# Altium project Jetson AGX Xavier Carrier Board.PrjPcb (part 6 of 8)

## Sheet RGMII ETHERNET.SchDoc: RGMII Ethernet
size 431 x 279 mm; CheckedBy: Lance Bantoto; Engineer: Chealsie Bains; DocumentNumber: 17; Revision: 1; SheetNumber: 17; SheetTotal: 23
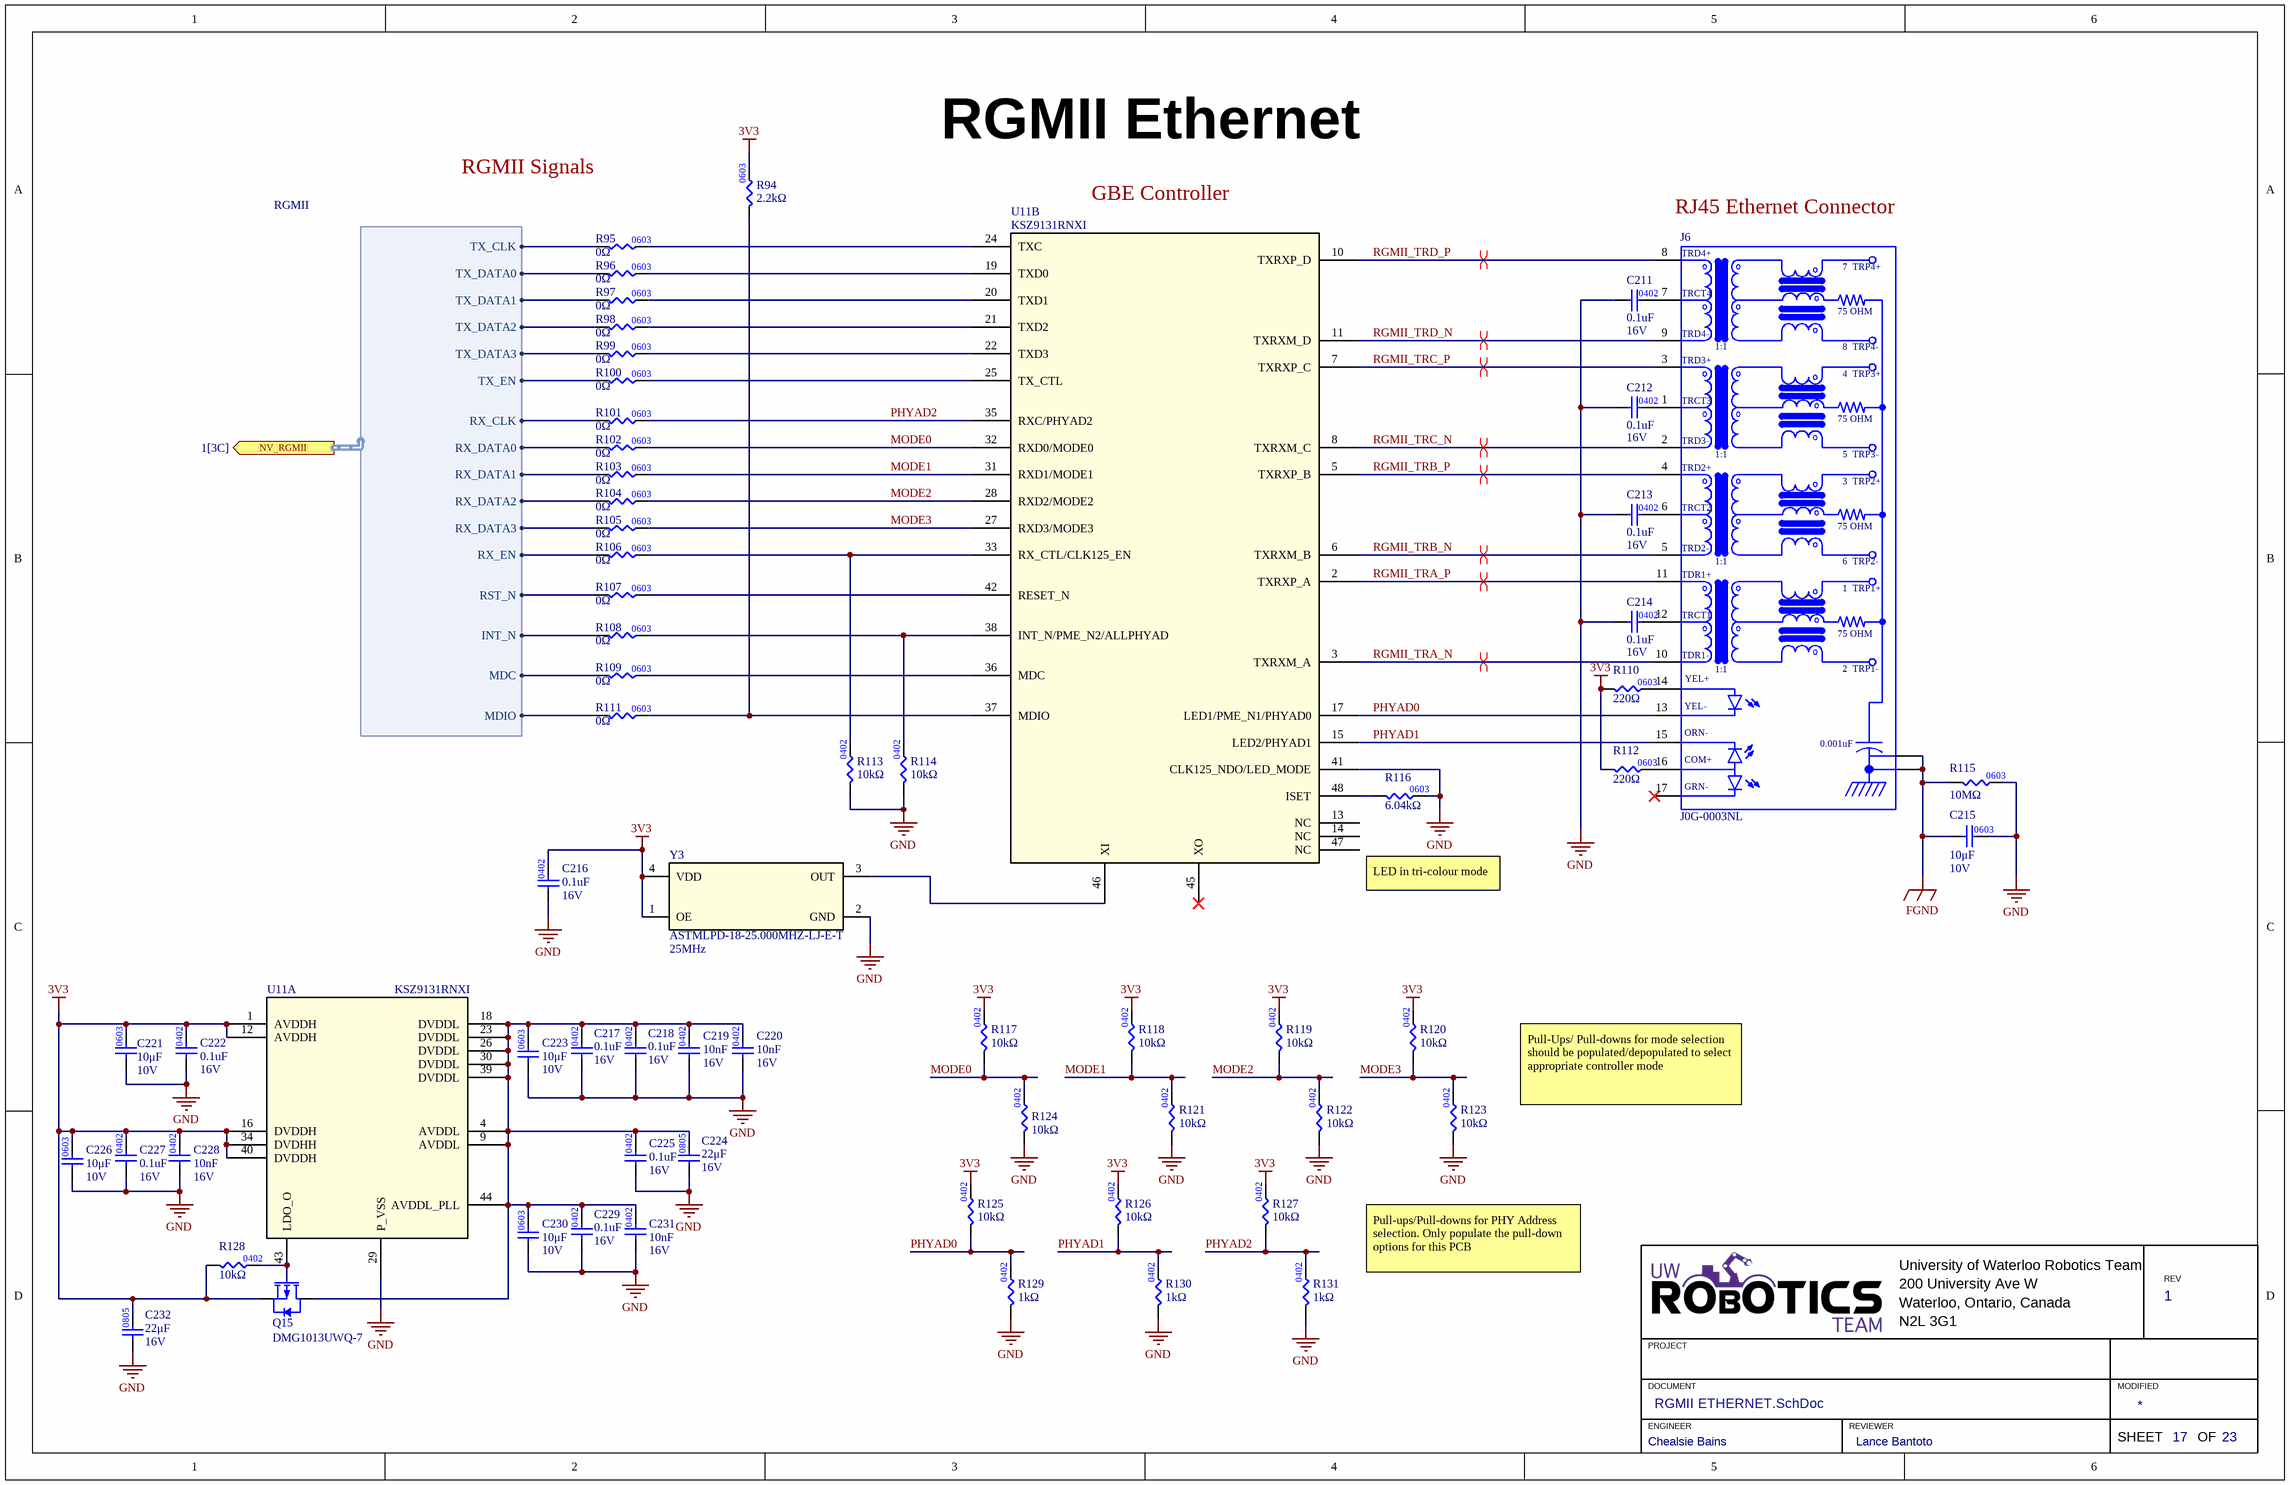
[diagram p19: RGMII ETHERNET.SchDoc]

### Parts
C211  Capacitance: 0.1uF  Rated DC Voltage (URdc): 16V  [CAP0402]  (hidden comment: CAP_0.1uF_16V_X7R_0402)
C212  Capacitance: 0.1uF  Rated DC Voltage (URdc): 16V  [CAP0402]  (hidden comment: CAP_0.1uF_16V_X7R_0402)
C213  Capacitance: 0.1uF  Rated DC Voltage (URdc): 16V  [CAP0402]  (hidden comment: CAP_0.1uF_16V_X7R_0402)
C214  Capacitance: 0.1uF  Rated DC Voltage (URdc): 16V  [CAP0402]  (hidden comment: CAP_0.1uF_16V_X7R_0402)
C215  value 10μF  Voltage Rating: 10V  [CAP0603]  (hidden comment: CAP_10uF_10V_0603)
C216  Capacitance: 0.1uF  Rated DC Voltage (URdc): 16V  [CAP0402]  (hidden comment: CAP_0.1uF_16V_X7R_0402)
C217  Capacitance: 0.1uF  Rated DC Voltage (URdc): 16V  [CAP0402]  (hidden comment: CAP_0.1uF_16V_X7R_0402)
C218  Capacitance: 0.1uF  Rated DC Voltage (URdc): 16V  [CAP0402]  (hidden comment: CAP_0.1uF_16V_X7R_0402)
C219  Capacitance: 10nF  Rated DC Voltage (URdc): 16V  [CAP0402]  (hidden comment: CAP_0.01uF_16V_X7R_0402)
C220  Capacitance: 10nF  Rated DC Voltage (URdc): 16V  [CAP0402]  (hidden comment: CAP_0.01uF_16V_X7R_0402)
C221  value 10μF  Voltage Rating: 10V  [CAP0603]  (hidden comment: CAP_10uF_10V_0603)
C222  Rated DC Voltage (URdc): 16V  Capacitance: 0.1uF  [CAP0402]  (hidden comment: CAP_0.1uF_16V_X7R_0402)
C223  value 10μF  Voltage Rating: 10V  [CAP0603]  (hidden comment: CAP_10uF_10V_0603)
C224  value 22μF  Voltage Rating: 16V  [CAP2012]  (hidden comment: CAP_22uF_16V_0805)
C225  Rated DC Voltage (URdc): 16V  Capacitance: 0.1uF  [CAP0402]  (hidden comment: CAP_0.1uF_16V_X7R_0402)
C226  value 10μF  Voltage Rating: 10V  [CAP0603]  (hidden comment: CAP_10uF_10V_0603)
C227  Rated DC Voltage (URdc): 16V  Capacitance: 0.1uF  [CAP0402]  (hidden comment: CAP_0.1uF_16V_X7R_0402)
C228  Capacitance: 10nF  Rated DC Voltage (URdc): 16V  [CAP0402]  (hidden comment: CAP_0.01uF_16V_X7R_0402)
C229  Capacitance: 0.1uF  Rated DC Voltage (URdc): 16V  [CAP0402]  (hidden comment: CAP_0.1uF_16V_X7R_0402)
C230  value 10μF  Voltage Rating: 10V  [CAP0603]  (hidden comment: CAP_10uF_10V_0603)
C231  Capacitance: 10nF  Rated DC Voltage (URdc): 16V  [CAP0402]  (hidden comment: CAP_0.01uF_16V_X7R_0402)
C232  value 22μF  Voltage Rating: 16V  [CAP2012]  (hidden comment: CAP_22uF_16V_0805)
J6  J0G-0003NL  [PULSE_J0G-0003NL]
Q15  Manufacturer Part Number: DMG1013UWQ-7  (hidden comment: PMOS_20V_820MA SOT323)
R94  value 2.2kΩ  [RES0603]  (hidden comment: RES_2.2kΩ_0603_1%)
R95  value 0Ω  [RES0603]  (hidden comment: RES_0Ω_0603)
R96  value 0Ω  [RES0603]  (hidden comment: RES_0Ω_0603)
R97  value 0Ω  [RES0603]  (hidden comment: RES_0Ω_0603)
R98  value 0Ω  [RES0603]  (hidden comment: RES_0Ω_0603)
R99  value 0Ω  [RES0603]  (hidden comment: RES_0Ω_0603)
R100  value 0Ω  [RES0603]  (hidden comment: RES_0Ω_0603)
R101  value 0Ω  [RES0603]  (hidden comment: RES_0Ω_0603)
R102  value 0Ω  [RES0603]  (hidden comment: RES_0Ω_0603)
R103  value 0Ω  [RES0603]  (hidden comment: RES_0Ω_0603)
R104  value 0Ω  [RES0603]  (hidden comment: RES_0Ω_0603)
R105  value 0Ω  [RES0603]  (hidden comment: RES_0Ω_0603)
R106  value 0Ω  [RES0603]  (hidden comment: RES_0Ω_0603)
R107  value 0Ω  [RES0603]  (hidden comment: RES_0Ω_0603)
R108  value 0Ω  [RES0603]  (hidden comment: RES_0Ω_0603)
R109  value 0Ω  [RES0603]  (hidden comment: RES_0Ω_0603)
R110  value 220Ω  [RES0603]  (hidden comment: RES_220Ω_0603)
R111  value 0Ω  [RES0603]  (hidden comment: RES_0Ω_0603)
R112  value 220Ω  [RES0603]  (hidden comment: RES_220Ω_0603)
R113  Resistance: 10kΩ  [RES0402]  (hidden comment: RES_10kΩ_0402_1%)
R114  Resistance: 10kΩ  [RES0402]  (hidden comment: RES_10kΩ_0402_1%)
R115  value 10MΩ  [RES0603]  (hidden comment: RES_10MΩ_0603)
R116  value 6.04kΩ  [RES0603]  (hidden comment: RES_6.04kΩ_0603_1%)
R117  Resistance: 10kΩ  [RES0402]  (hidden comment: RES_10kΩ_0402_1%)
R118  Resistance: 10kΩ  [RES0402]  (hidden comment: RES_10kΩ_0402_1%)
R119  Resistance: 10kΩ  [RES0402]  (hidden comment: RES_10kΩ_0402_1%)
R120  Resistance: 10kΩ  [RES0402]  (hidden comment: RES_10kΩ_0402_1%)
R121  Resistance: 10kΩ  [RES0402]  (hidden comment: RES_10kΩ_0402_1%)
R122  Resistance: 10kΩ  [RES0402]  (hidden comment: RES_10kΩ_0402_1%)
R123  Resistance: 10kΩ  [RES0402]  (hidden comment: RES_10kΩ_0402_1%)
R124  Resistance: 10kΩ  [RES0402]  (hidden comment: RES_10kΩ_0402_1%)
R125  Resistance: 10kΩ  [RES0402]  (hidden comment: RES_10kΩ_0402_1%)
R126  Resistance: 10kΩ  [RES0402]  (hidden comment: RES_10kΩ_0402_1%)
R127  Resistance: 10kΩ  [RES0402]  (hidden comment: RES_10kΩ_0402_1%)
R128  Resistance: 10kΩ  [RES0805]  (hidden comment: RES_10kΩ_0402)
R129  value 1kΩ  [RES0402]  (hidden comment: RES_1kΩ_0402_1%)
R130  value 1kΩ  [RES0402]  (hidden comment: RES_1kΩ_0402_1%)
R131  value 1kΩ  [RES0402]  (hidden comment: RES_1kΩ_0402_1%)
U11  KSZ9131RNXI  [KSZ9131RNXI]  (parts A,B of 2)
Y3  ASTMLPD-18-25.000MHZ-LJ-E-T  value 25MHz  [ASTMLPE_ABR]

### Ports
NV_RGMII (out, harness RGMII, see 1[3C])

### Harnesses
RGMII: TX_CLK, TX_DATA0, TX_DATA1, TX_DATA3, TX_DATA2, TX_EN, RX_CLK, RX_DATA0, RX_DATA1, RX_DATA2, RX_DATA3, RX_EN, RST_N, INT_N, MDC, MDIO

### Nets
3V3: C216.2 C221.2 C222.2 C226.2 C227.2 C228.2 C232.2 Q15.3(Source) R94.2 R110.1 R112.1 R117.2 R118.2 R119.2 R120.2 R125.2 R126.2 R127.2 R128.1 U11.1(AVDDH) U11.12(AVDDH) U11.16(DVDDH) U11.34(DVDHH) U11.40(DVDDH) Y3.1(OE) Y3.4(VDD)
FGND: C215.1 J6.SH1(SHIELD) J6.SH2(SHIELD) R115.1
GND: C211.1 C212.1 C213.1 C214.1 C215.2 C216.1 C217.1 C218.1 C219.1 C220.1 C221.1 C222.1 C223.1 C224.1 C225.1 C226.1 C227.1 C228.1 C229.1 C230.1 C231.1 C232.1 R113.1 R114.1 R115.2 R116.2 R121.1 R122.1 R123.1 R124.1 R129.1 R130.1 R131.1 U11.29(P_VSS) U11.41(CLK125_NDO/LED_MODE) Y3.2(GND)
MODE0: R102.2 R117.1 R124.2 U11.32(RXD0/MODE0)
MODE1: R103.2 R118.1 R121.2 U11.31(RXD1/MODE1)
MODE2: R104.2 R119.1 R122.2 U11.28(RXD2/MODE2)
MODE3: R105.2 R120.1 R123.2 U11.27(RXD3/MODE3)
NV_RGMII.INT_N: R108.1 ; port NV_RGMII.INT_N
NV_RGMII.MDC: R109.1 ; port NV_RGMII.MDC
NV_RGMII.MDIO: R111.1 ; port NV_RGMII.MDIO
NV_RGMII.RST_N: R107.1 ; port NV_RGMII.RST_N
NV_RGMII.RX_CLK: R101.1 ; port NV_RGMII.RX_CLK
NV_RGMII.RX_DATA0: R102.1 ; port NV_RGMII.RX_DATA0
NV_RGMII.RX_DATA1: R103.1 ; port NV_RGMII.RX_DATA1
NV_RGMII.RX_DATA2: R104.1 ; port NV_RGMII.RX_DATA2
NV_RGMII.RX_DATA3: R105.1 ; port NV_RGMII.RX_DATA3
NV_RGMII.RX_EN: R106.1 ; port NV_RGMII.RX_EN
NV_RGMII.TX_CLK: R95.1 ; port NV_RGMII.TX_CLK
NV_RGMII.TX_DATA0: R96.1 ; port NV_RGMII.TX_DATA0
NV_RGMII.TX_DATA1: R97.1 ; port NV_RGMII.TX_DATA1
NV_RGMII.TX_DATA2: R98.1 ; port NV_RGMII.TX_DATA2
NV_RGMII.TX_DATA3: R99.1 ; port NV_RGMII.TX_DATA3
NV_RGMII.TX_EN: R100.1 ; port NV_RGMII.TX_EN
PHYAD0: J6.13(YEL-) R125.1 R129.2 U11.17(LED1/PME_N1/PHYAD0)
PHYAD1: J6.15(ORN-) R126.1 R130.2 U11.15(LED2/PHYAD1)
PHYAD2: R101.2 R127.1 R131.2 U11.35(RXC/PHYAD2)
RGMII_TRA_N: J6.10(TDR1-) U11.3(TXRXM_A)
RGMII_TRA_P: J6.11(TDR1+) U11.2(TXRXP_A)
RGMII_TRB_N: J6.5(TRD2-) U11.6(TXRXM_B)
RGMII_TRB_P: J6.4(TRD2+) U11.5(TXRXP_B)
RGMII_TRC_N: J6.2(TRD3-) U11.8(TXRXM_C)
RGMII_TRC_P: J6.3(TRD3+) U11.7(TXRXP_C)
RGMII_TRD_N: J6.9(TRD4-) U11.11(TXRXM_D)
RGMII_TRD_P: J6.8(TRD4+) U11.10(TXRXP_D)
NetC211_2: C211.2 J6.7(TRCT4)
NetC212_2: C212.2 J6.1(TRCT3)
NetC213_2: C213.2 J6.6(TRCT2)
NetC214_2: C214.2 J6.12(TRCT1)
NetC217_2: C217.2 C218.2 C219.2 C220.2 C223.2 C224.2 C225.2 C229.2 C230.2 C231.2 Q15.1(Drain) U11.4(AVDDL) U11.9(AVDDL) U11.18(DVDDL) U11.23(DVDDL) U11.26(DVDDL) U11.30(DVDDL) U11.39(DVDDL) U11.44(AVDDL_PLL)
NetJ6_14: J6.14(YEL+) R110.2
NetJ6_16: J6.16(COM+) R112.2
NetQ15_2: Q15.2(Gate) R128.2 U11.43(LDO_O)
NetR94_1: R94.1 R111.2 U11.37(MDIO)
NetR95_2: R95.2 U11.24(TXC)
NetR96_2: R96.2 U11.19(TXD0)
NetR97_2: R97.2 U11.20(TXD1)
NetR98_2: R98.2 U11.21(TXD2)
NetR99_2: R99.2 U11.22(TXD3)
NetR100_2: R100.2 U11.25(TX_CTL)
NetR106_2: R106.2 R113.2 U11.33(RX_CTL/CLK125_EN)
NetR107_2: R107.2 U11.42(RESET_N)
NetR108_2: R108.2 R114.2 U11.38(INT_N/PME_N2/ALLPHYAD)
NetR109_2: R109.2 U11.36(MDC)
NetR116_1: R116.1 U11.48(ISET)
NetU11_46: U11.46(XI) Y3.3(OUT)

Not connected (* = marked no-connect by the designer): J6 17(GRN-)*; U11 13(NC) 14(NC) 45(XO)* 47(NC)

### Layout directives
differential pair: RGMII_TRA_N, RGMII_TRA_P, RGMII_TRB_N, RGMII_TRB_P, RGMII_TRC_N, RGMII_TRC_P, RGMII_TRD_N, RGMII_TRD_P

### Notes on the sheet
- RGMII Signals
- (near U11) GBE Controller
- (near J6) RJ45 Ethernet Connector
- LED in tri-colour mode
- Pull-Ups/ Pull-downs for mode selection should be populated/depopulated to select appropriate controller mode
- Pull-ups/Pull-downs for PHY Address selection. Only populate the pull-down options for this PCB
- University of Waterloo Robotics Team
- 200 University Ave W
- REV
- PROJECT
- Waterloo, Ontario, Canada
- N2L 3G1
- DOCUMENT
- ENGINEER
- REVIEWER
- MODIFIED
- SHEET
- OF
- (in symbol CAP_10uF_10V_0603) 0603
- (in symbol J0G-0003NL) 7  TRP4+; 75 OHM; 1:1; 8  TRP4-; 4  TRP3+; 5  TRP3-; 3  TRP2+; 6  TRP2-; 1  TRP1+; 2  TRP1-; 0.001uF
- (in symbol RES_10MΩ_0603_5%) 0603

### Library data of the parts
C211-C214 C216-C218 C222 C225 C227 C229 = CAP_0.1uF_16V_X7R_0402: Ceramic Capacitor, Ceramic; Manufacturer: Taiyo Yuden; Manufacturer Part Number: LMK212AC6106MD-T; Multilayer: Yes; Negative Tolerance: 10%; Temperature Characteristics Code: X7R; Supplier 1: Digi-Key; Supplier Part Number 1: 587-6337-1-ND; RoHS: Yes; Stock 1: 703; Pricing 1: 1=0.29000, 10=0.20100, 50=0.12060, 100=0.10180, 500=0.06966, 1000=0.06163 (USD); ComponentLink1URL: https://datasheet.ciiva.com:443/pdfs/VipMasterIC/IC/TAIY/TAIY-S-A0009099504/TAIY-S-A0009099407-1.pdf?src-supplier=IHS+Markit; ComponentLink1Description: https://datasheet.ciiva.com:443/pdfs/VipMasterIC/IC/TAIY/TAIY-S-A0009099504/TAIY-S-A0009099407-1.pdf?src-supplier=IHS+Markit; ComponentLink2URL: https://ds.yuden.co.jp/TYCOMPAS/ut/detail?pn=LMK212AC6106MD-T &amp;u=M&src-supplier=Digi-Key; ComponentLink2Description: https://ds.yuden.co.jp/TYCOMPAS/ut/detail?pn=LMK212AC6106MD-T &amp;u=M&src-supplier=Digi-Key; Supplier 2: Digi-Key; Supplier Part Number 2: 1292-1630-1-ND; Category: Ceramic Capacitors; Stock 2: 20327886; Pricing 2: 1=0.10000, 10=0.02800, 50=0.01500, 100=0.01220, 500=0.00876, 1000=0.00688, 2500=0.00625, 5000=0.00575 (USD); Mount: Surface Mount; Number of Pins: 2; Dielectric Material: Ceramic; Package Shape: Rectangular; Terminal Finish: Nickel; Min Operating Temperature: -55°C; Max Operating Temperature: 125°C; JESD-609 Code: e3; Capacitor Type: Ceramic; Package Style: SMTMeter; Packaging: Tape and Reel; Positive Tolerance: 10%; Termination: Wraparound; Length: 1mm; Width: 0.5mm; Height: 0.5mm; REACH SVHC: Yes; RoHS Compliant: Yes; ComponentLink3URL: https://datasheet.ciiva.com:443/pdfs/VipMasterIC/IC/WATC/WATC-S-A0009550342/WATC-S-A0009550342-1.pdf?src-supplier=IHS+Markit; ComponentLink3Description: https://datasheet.ciiva.com:443/pdfs/VipMasterIC/IC/WATC/WATC-S-A0009550342/WATC-S-A0009550342-1.pdf?src-supplier=IHS+Markit; ComponentLink4URL: http://www.farnell.com/datasheets/2340522.pdf?src-supplier=Farnell; ComponentLink4Description: http://www.farnell.com/datasheets/2340522.pdf?src-supplier=Farnell; ComponentLink5URL: http://components.arrow.com/part/dataview/0323_00654690?src-supplier=Arrow+Europe; ComponentLink5Description: http://components.arrow.com/part/dataview/0323_00654690?src-supplier=Arrow+Europe; ComponentLink6URL: https://www.verical.com/server-webapp/html/getDatasheet?partID=415228&src-supplier=Verical; ComponentLink6Description: https://www.verical.com/server-webapp/html/getDatasheet?partID=415228&src-supplier=Verical; ComponentLink7URL: http://www.passivecomponent.com/indexsea/0402B104K160CT-IN.pdf?src-supplier=Digi-Key; ComponentLink7Description: http://www.passivecomponent.com/indexsea/0402B104K160CT-IN.pdf?src-supplier=Digi-Key; ComponentLink8URL: http://www.passivecomponent.com/wp-content/uploads/2018/10/MLCC.pdf?src-supplier=Digi-Key; ComponentLink8Description: http://www.passivecomponent.com/wp-content/uploads/2018/10/MLCC.pdf?src-supplier=Digi-Key; ComponentLink9URL: http://www.farnell.com/datasheets/2340522.pdf?src-supplier=Element14; ComponentLink9Description: http://www.farnell.com/datasheets/2340522.pdf?src-supplier=Element14; ComponentLink10URL: http://www.farnell.com/datasheets/2340522.pdf?src-supplier=Newark; ComponentLink10Description: http://www.farnell.com/datasheets/2340522.pdf?src-supplier=Newark; Size Code: 0402; Supplier 3: Digi-Key; Supplier Part Number 3: 445-173645-1-ND; Stock 3: 3627; Pricing 3: 1=0.20000, 10=0.14200, 50=0.08080, 100=0.06700, 500=0.04696, 1000=0.03888, 2500=0.03619, 5000=0.03311 (USD); ComponentLink11URL: https://datasheet.ciiva.com:443/pdfs/VipMasterIC/IC/TDKC/TDKC-S-A0007785269/TDKC-S-A0007785269-1.pdf?src-supplier=IHS+Markit; ComponentLink11Description: https://datasheet.ciiva.com:443/pdfs/VipMasterIC/IC/TDKC/TDKC-S-A0007785269/TDKC-S-A0007785269-1.pdf?src-supplier=IHS+Markit; ComponentLink12URL: https://product.tdk.com/info/en/catalog/spec/mlccspec_commercial_soft_en.pdf?src-supplier=Digi-Key; ComponentLink12Description: https://product.tdk.com/info/en/catalog/spec/mlccspec_commercial_soft_en.pdf?src-supplier=Digi-Key
C215 C221 C223 C226 C230 = CAP_10uF_10V_0603: CAP CER 10UF 10V X5R 0603; Manufacturer Part Number 1: CC0603MRX5R6BB106; Manufacturer 1: Yageo; Supplier Part Number 1: 311-1817-1-ND; Supplier 1: Digi-Key; Dielectric: X5R
C219 C220 C228 C231 = CAP_0.01uF_16V_X7R_0402: Ceramic Capacitor, Multilayer, Ceramic, 16V, 5% +Tol, 5% -Tol, X7R, 15% TC, 0.01uF, Surface Mount, 0402; Manufacturer: KEMET; Manufacturer Part Number: C0402C103J4RACTU; Multilayer: Yes; Supplier 1: Digi-Key; Supplier Part Number 1: 399-1039-1-ND; RoHS: Yes; Category: Ceramic Capacitors; Stock 1: 29300; Pricing 1: 1=0.10000, 10=0.04000, 50=0.02200, 100=0.01800, 500=0.01288, 1000=0.01012, 2500=0.00920, 5000=0.00846 (USD); Mount: Surface Mount; Number of Pins: 2; Dielectric Material: Ceramic; Package Shape: Rectangular; Terminal Finish: Nickel; Min Operating Temperature: -55°C; Max Operating Temperature: 125°C; JESD-609 Code: e3; Capacitor Type: Ceramic; Negative Tolerance: 5%; Package Style: SMTMeter; Packaging: Tape and Reel; Positive Tolerance: 5%; Temperature Characteristics Code: X7R; Termination: Wraparound; Length: 1mm; Width: 0.5mm; Height: 0.5mm; REACH SVHC: Yes; RoHS Compliant: Yes; ComponentLink1URL: https://datasheet.ciiva.com:443/pdfs/VipMasterIC/IC/KEME/KEME-S-A0008991654/KEME-S-A0008991654-1.pdf?src-supplier=IHS+Markit; ComponentLink1Description: https://datasheet.ciiva.com:443/pdfs/VipMasterIC/IC/KEME/KEME-S-A0008991654/KEME-S-A0008991654-1.pdf?src-supplier=IHS+Markit; ComponentLink2URL: https://datasheet.ciiva.com/14593/70095383-14593069.pdf?src-supplier=Allied+Electronics; ComponentLink2Description: https://datasheet.ciiva.com/14593/70095383-14593069.pdf?src-supplier=Allied+Electronics; ComponentLink3URL: https://datasheet.ciiva.com/14604/70095383-14604557.pdf?src-supplier=Allied+Electronics; ComponentLink3Description: https://datasheet.ciiva.com/14604/70095383-14604557.pdf?src-supplier=Allied+Electronics; ComponentLink4URL: https://datasheet.ciiva.com/7747/kem-c1002-x7r-smd-7747611.pdf?src-supplier=Element14; ComponentLink4Description: https://datasheet.ciiva.com/7747/kem-c1002-x7r-smd-7747611.pdf?src-supplier=Element14; ComponentLink5URL: https://datasheet.ciiva.com/46448/1851736-46448647.pdf?src-supplier=Element14; ComponentLink5Description: https://datasheet.ciiva.com/46448/1851736-46448647.pdf?src-supplier=Element14; ComponentLink6URL: https://datasheet.ciiva.com/28645/1851736-28645374.pdf?src-supplier=Element14; ComponentLink6Description: https://datasheet.ciiva.com/28645/1851736-28645374.pdf?src-supplier=Element14; Size Code: 0402
C224 C232 = CAP_22uF_16V_0805: CAP CER 22UF 16V X5R 0805; Manufacturer 1: Murata Electronics; Manufacturer Part Number 1: GRM219R61C226ME15L; Package/Footprint: 0805; Mounting Type: SMD; Supplier 1: Digi-Key; Supplier Part Number 1: 490-9952-1-ND; Dielectric: X5R
J6 = J0G-0003NL: 1 Port RJ45 Magjack Connector Through Hole 10/100/1000 Base-T, AutoMDIX; MF: Pulse Electronics; Digi-Key_Part_Number: 553-1852-ND; Package: Custom Package Pulse Electronics Network; MP: J0G-0003NL; SnapEDA_Link: https://www.snapeda.com/parts/J0G-0003NL/Pulse%20Electronics%20Network/view-part/368728/?ref=snap; Digi-Key_Purchase_URL: https://www.digikey.com/product-detail/en/pulse-electronics-network/J0G-0003NL/553-1852-ND/2264761?utm_source=snapeda&utm_medium=aggregator&utm_campaign=symbol; Value: *
Q15 = PMOS_20V_820MA SOT323: Small Signal Field-Effect Transistor, 0.82A I(D), 20V, 1-Element, P-Channel, Silicon, Metal-oxide Semiconductor FET; Manufacturer: Diodes; Supplier 1: Digi-Key; Supplier Part Number 1: DMG1013UWQ-7DICT-ND; RoHS: Yes; Category: MOSFETs; Stock 1: 30274; Pricing 1: 1=0.37000, 10=0.27300, 25=0.23880, 100=0.15450, 500=0.10230, 1000=0.07843 (USD); ComponentLink1URL: https://datasheet.ciiva.com:443/pdfs/VipMasterIC/IC/DIOD/DIOD-S-A0002497929/DIOD-S-A0002497929-1.pdf?src-supplier=IHS+Markit; ComponentLink1Description: https://datasheet.ciiva.com:443/pdfs/VipMasterIC/IC/DIOD/DIOD-S-A0002497929/DIOD-S-A0002497929-1.pdf?src-supplier=IHS+Markit; ComponentLink2URL: http://www.farnell.com/datasheets/2814383.pdf?src-supplier=Farnell; ComponentLink2Description: http://www.farnell.com/datasheets/2814383.pdf?src-supplier=Farnell; ComponentLink3URL: http://www.mouser.com/ds/2/115/DMG1013UWQ-892513.pdf?src-supplier=Mouser; ComponentLink3Description: http://www.mouser.com/ds/2/115/DMG1013UWQ-892513.pdf?src-supplier=Mouser; ComponentLink4URL: https://www.diodes.com/assets/Datasheets/DMG1013UWQ.pdf?src-supplier=Digi-Key; ComponentLink4Description: https://www.diodes.com/assets/Datasheets/DMG1013UWQ.pdf?src-supplier=Digi-Key; ComponentLink5URL: http://www.farnell.com/datasheets/2814383.pdf?src-supplier=Element14; ComponentLink5Description: http://www.farnell.com/datasheets/2814383.pdf?src-supplier=Element14; ComponentLink6URL: http://www.farnell.com/datasheets/2814383.pdf?src-supplier=Newark; ComponentLink6Description: http://www.farnell.com/datasheets/2814383.pdf?src-supplier=Newark
R94 = RES_2.2kΩ_0603_1%: RES 2.2K OHM 1% 1/10W 0603; Manufacturer 1: Yageo; Manufacturer Part Number 1: RC0603FR-072K2L; Supplier Part Number 1: 311-2.20KHRCT-ND; Supplier 1: Digi-Key; Mounting Type: SMD; Package: 0603
R95-R109 R111 = RES_0Ω_0603: RES 0 OHM JUMPER 1/10W 0603; Manufacturer 1: Yageo; Manufacturer Part Number 1: RC0603JR-070RL; Package/Footprint: 0603; Supplier Part Number 1: 311-0.0GRCT-ND; Supplier 1: Digi-Key; Mounting Type: SMD
R110 R112 = RES_220Ω_0603_5%: RES 220 OHM 5% 1/10W 0603; Manufacturer 1: Yageo; Manufacturer Part Number 1: AC0603JR-07220RL; Package/Footprint: 0603; Supplier Part Number 1: YAG3652CT-ND; Supplier 1: Digi-Key
R113 R114 R117-R127 = RES_10kΩ_0402_1%: RES 10K OHM 1% 1/16W 0402; Manufacturer 1: Samsung Electro-Mechanics; Manufacturer Part Number 1: RC1005F103CS; Supplier 1: Digi-Key; Supplier Part Number 1: 1276-3431-1-ND; Tolerance: 1%; Package: 0402
R115 = RES_10MΩ_0603_5%: RES 10M OHM 5% 1/10W 0603; Manufacturer 1: Vishay Dale; Manufacturer Part Number 1: CRCW060310M0JNEA; Supplier Part Number 1: 541-10MGCT-ND; Supplier 1: Digi-Key
R116 = RES_6.04kΩ_0603_1%: RES 6.04K OHM 1% 1/10W 0603; Manufacturer 1: Panasonic Electronic Components; Manufacturer Part Number 1: ERJ-PB3D6041V; Package/Footprint: 0603; Supplier 1: Digi-Key; Supplier Part Number 1: P20372CT-ND; Mounting Type: SMD
R128 = RES_10kΩ_0402: Fixed Resistor, Thin Film, 0.1W, 10000ohm, 50V, 0.1% +/-Tol, 25ppm/Cel, Surface Mount, 0402; Manufacturer 1: Panasonic; Manufacturer Part Number 1: ERJ-PB6B6043V; Manufacturer: Stackpole Electronics; Manufacturer Part Number: RNCF0402BTE10K0; Additional Feature: PRECISION; Rated Power Dissipation (P): 63mW; Rated Temperature: 70°C; Temperature Coefficient: 25ppm/°C; Working Voltage: 25V; Package Height: 0.3mm; Package Length: 1mm; Package Width: 0.5mm; Reference Standard: AEC-Q200; Supplier 1: Digi-Key; Supplier Part Number 1: P20911CT-ND; Supplier 2: Digi-Key; Supplier Part Number 2: RNCF0402BTE10K0CT-ND; RoHS: Yes; Category: Chip SMD Resistors; Stock 2: 76384; Pricing 2: 1=0.36000, 10=0.25900, 100=0.10350, 1000=0.05100, 2500=0.04725, 5000=0.04275 (USD); Mount: Surface Mount; Number of Pins: 2; Package Shape: Rectangular; Terminal Finish: Nickel; Min Operating Temperature: -55°C; Max Operating Temperature: 155°C; Tolerance: 0.1%; JESD-609 Code: e3; Resistor Type: FIXED RESISTOR; Construction: Rectangular; Package Style: SMTMeter; Packaging: Tape and Reel; Technology: THIN FILM; Termination: Wraparound; REACH SVHC: Yes; RoHS Compliant: Yes; ComponentLink1URL: https://datasheet.ciiva.com:443/pdfs/VipMasterIC/IC/SEIE/SEIE-S-A0009648208/SEIE-S-A0009648208-1.pdf?src-supplier=IHS+Markit; ComponentLink1Description: https://datasheet.ciiva.com:443/pdfs/VipMasterIC/IC/SEIE/SEIE-S-A0009648208/SEIE-S-A0009648208-1.pdf?src-supplier=IHS+Markit; ComponentLink2URL: https://www.seielect.com/catalog/SEI-Packaging.pdf?src-supplier=Digi-Key; ComponentLink2Description: https://www.seielect.com/catalog/SEI-Packaging.pdf?src-supplier=Digi-Key; ComponentLink3URL: https://www.seielect.com/Catalog/SEI-rncf.pdf?src-supplier=Avnet; ComponentLink3Description: https://www.seielect.com/Catalog/SEI-rncf.pdf?src-supplier=Avnet; Size Code: 0402
R129-R131 = RES_1kΩ_0402_1%: RES 1K OHM 1% 1/16W 0402; Manufacturer 1: Stackpole Electronics; Manufacturer Part Number 1: RMCF0402FT1K00; Supplier 1: Digi-Key; Supplier Part Number 1: RMCF0402FT1K00CT-ND; Tolerance: 1%; Package: 0402
U11 = KSZ9131RNXI: Ethernet Transceiver, PQCC48; Manufacturer: Microchip Technologies; Manufacturer Product Number: KSZ9131RNXI
Y3 = ASTMLPD-18-25.000MHZ-LJ-E-T: MEMS OSC XO 25.0000MHZ LVCMOS; Manufacturer 1: Abracon; Manufacturer Part Number 1: ASTMLPD-18-25.000MHZ-LJ-E-T; Supplier 1: Digi-Key; Supplier Part Number 1: 535-13096-1-ND

## Sheet System.SchDoc: System
size 431 x 279 mm; CheckedBy: Lance Bantoto; Engineer: Chealsie Bains; DocumentNumber: 12; Revision: 1; SheetNumber: 12; SheetTotal: 23
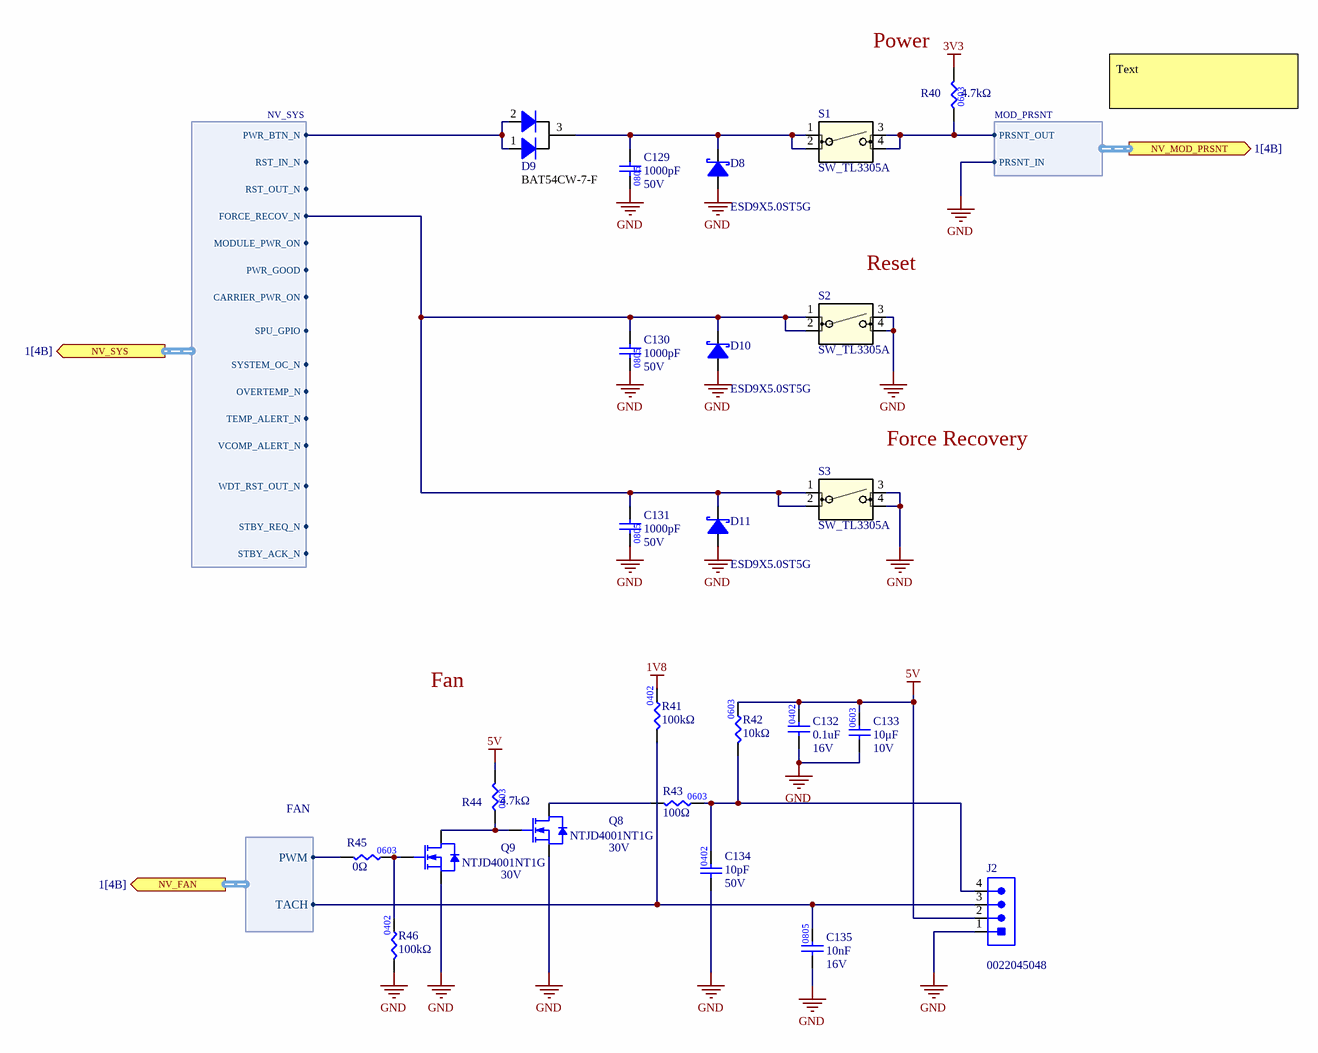
[diagram p20: System.SchDoc]

### Parts
C129  value 1000pF  Voltage Rating: 50V  [CAP2012]  (hidden comment: CAP_1000pF_50V_0805)
C130  value 1000pF  Voltage Rating: 50V  [CAP2012]  (hidden comment: CAP_1000pF_50V_0805)
C131  value 1000pF  Voltage Rating: 50V  [CAP2012]  (hidden comment: CAP_1000pF_50V_0805)
C132  Rated DC Voltage (URdc): 16V  Capacitance: 0.1uF  [CAP0402]  (hidden comment: CAP_0.1uF_16V_X7R_0402)
C133  value 10μF  Voltage Rating: 10V  [CAP0603]  (hidden comment: CAP_10uF_10V_0603)
C134  Capacitance: 10pF  Voltage: 50V  [CAP0402]  (hidden comment: CAP_10pF_50V_0402)
C135  value 10nF  Voltage Rating: 16V  [CAP2012]  (hidden comment: CAP_10nF_16V_0805)
D8  Manufacturer Part Number 1: ESD9X5.0ST5G  [SOD-923]  (hidden comment: TVS_DIODE_UNIDIR_5V)
D9  BAT54CW-7-F  [SOT323]
D10  Manufacturer Part Number 1: ESD9X5.0ST5G  [SOD-923]  (hidden comment: TVS_DIODE_UNIDIR_5V)
D11  Manufacturer Part Number 1: ESD9X5.0ST5G  [SOD-923]  (hidden comment: TVS_DIODE_UNIDIR_5V)
J2  Manufacturer Part Number: 0022045048  (hidden comment: CON_4POS)
Q8  DS Breakdown Voltage-Min: 30V  Manufacturer Part Number 1: NTJD4001NT1G  [SOT363]  (hidden comment: NMOS_30V_0.25A)
Q9  DS Breakdown Voltage-Min: 30V  Manufacturer Part Number 1: NTJD4001NT1G  [SOT363]  (hidden comment: NMOS_30V_0.25A)
R40  value 4.7kΩ  [RES0603]  (hidden comment: RES_4.7kΩ_0603)
R41  value 100kΩ  [RES0402]  (hidden comment: RES_100kΩ_0402_5%)
R42  value 10kΩ  [RES0603]  (hidden comment: RES_10kΩ_0603_5%)
R43  value 100Ω  [RES0603]  (hidden comment: RES_100Ω_0603)
R44  value 4.7kΩ  [RES0603]  (hidden comment: RES_4.7kΩ_0603)
R45  value 0Ω  [RES0603]  (hidden comment: RES_0Ω_0603)
R46  value 100kΩ  [RES0402]  (hidden comment: RES_100kΩ_0402_5%)
S1  SW_TL3305A  [SW_TL3305AF260QG]
S2  SW_TL3305A  [SW_TL3305AF260QG]
S3  SW_TL3305A  [SW_TL3305AF260QG]

### Ports
NV_FAN (out, harness FAN, see 1[4B]), NV_MOD_PRSNT (out, harness MOD_PRSNT, see 1[4B]), NV_SYS (out, harness NV_SYS, see 1[4B])

### Harnesses
FAN: PWM, TACH
NV_SYS: PWR_BTN_N, RST_IN_N, RST_OUT_N, FORCE_RECOV_N, MODULE_PWR_ON, PWR_GOOD, CARRIER_PWR_ON, SPU_GPIO, SYSTEM_OC_N, OVERTEMP_N, TEMP_ALERT_N, VCOMP_ALERT_N, WDT_RST_OUT_N, STBY_REQ_N, STBY_ACK_N
MOD_PRSNT: PRSNT_IN, PRSNT_OUT

### Nets
1V8: R41.2
3V3: R40.2
5V: C132.2 C133.2 J2.2 R42.2 R44.2
GND: C129.1 C130.1 C131.1 C132.1 C133.1 C134.1 C135.1 D8.1(Anode) D10.1(Anode) D11.1(Anode) J2.1 Q8.2(SOURCE) Q9.2(SOURCE) R46.1 S2.3 S2.4 S3.3 S3.4 ; port NV_MOD_PRSNT.PRSNT_IN
NV_FAN.PWM: R45.1 ; port NV_FAN.PWM
NV_FAN.TACH: C135.2 J2.3 R41.1 ; port NV_FAN.TACH
NV_MOD_PRSNT.PRSNT_OUT: R40.1 S1.3 S1.4 ; port NV_MOD_PRSNT.PRSNT_OUT
NV_SYS.FORCE_RECOV_N: C130.2 C131.2 D10.2(Cathode) D11.2(Cathode) S2.1 S2.2 S3.1 S3.2 ; port NV_SYS.FORCE_RECOV_N
NV_SYS.PWR_BTN_N: D9.1 D9.2 ; port NV_SYS.PWR_BTN_N
NetC129_2: C129.2 D8.2(Cathode) S1.1 S1.2
NetC134_2: C134.2 J2.4 R42.1 R43.2
NetQ8_1: Q8.1(GATE) Q9.3(DRAIN) R44.1
NetQ8_3: Q8.3(DRAIN) R43.1
NetQ9_1: Q9.1(GATE) R45.2 R46.2

Not connected (* = marked no-connect by the designer): D9 3

### Notes on the sheet
- Power
- Text
- (near S2) Reset
- (near S3) Force Recovery
- Fan
- University of Waterloo Robotics Team
- 200 University Ave W
- REV
- PROJECT
- Waterloo, Ontario, Canada
- N2L 3G1
- DOCUMENT
- ENGINEER
- REVIEWER
- MODIFIED
- SHEET
- OF
- (in symbol CAP_10nF_16V_0805) 0805
- (in symbol CAP_10uF_10V_0603) 0603
- (in symbol RES_4.7kΩ_0603_5%) 0603
- (in symbol RES_100Ω_0603_1%) 0603

### Library data of the parts
C129-C131 = CAP_1000pF_50V_0805: CAP CER 1000pF 50V X7R 0805; Manufacturer 1: Samsung; Manufacturer Part Number 1: CL21B102KBANNNC; Package/Footprint: 0805; Supplier 1: Digi-Key; Mounting Type: SMD; Supplier Part Number 1: 1276-1020-1-ND; Dielectric: X7R
C132 = CAP_0.1uF_16V_X7R_0402: as C211-C214 on sheet RGMII ETHERNET; Supplier 1: Digi-Key; Supplier Part Number 1: 587-6337-1-ND; RoHS: Yes; Stock 1: 703; Pricing 1: 1=0.29000, 10=0.20100, 50=0.12060, 100=0.10180, 500=0.06966, 1000=0.06163 (USD); ComponentLink1URL: https://datasheet.ciiva.com:443/pdfs/VipMasterIC/IC/TAIY/TAIY-S-A0009099504/TAIY-S-A0009099407-1.pdf?src-supplier=IHS+Markit; ComponentLink1Description: https://datasheet.ciiva.com:443/pdfs/VipMasterIC/IC/TAIY/TAIY-S-A0009099504/TAIY-S-A0009099407-1.pdf?src-supplier=IHS+Markit; ComponentLink2URL: https://ds.yuden.co.jp/TYCOMPAS/ut/detail?pn=LMK212AC6106MD-T &amp;u=M&src-supplier=Digi-Key; ComponentLink2Description: https://ds.yuden.co.jp/TYCOMPAS/ut/detail?pn=LMK212AC6106MD-T &amp;u=M&src-supplier=Digi-Key; Supplier 2: Digi-Key; Supplier Part Number 2: 1292-1630-1-ND; Category: Ceramic Capacitors; Stock 2: 20327886; Pricing 2: 1=0.10000, 10=0.02800, 50=0.01500, 100=0.01220, 500=0.00876, 1000=0.00688, 2500=0.00625, 5000=0.00575 (USD); Mount: Surface Mount; Number of Pins: 2; Dielectric Material: Ceramic; Package Shape: Rectangular; Terminal Finish: Nickel; Min Operating Temperature: -55°C; Max Operating Temperature: 125°C; JESD-609 Code: e3; Capacitor Type: Ceramic; Package Style: SMTMeter; Packaging: Tape and Reel; Positive Tolerance: 10%; Termination: Wraparound; Length: 1mm; Width: 0.5mm; Height: 0.5mm; REACH SVHC: Yes; RoHS Compliant: Yes; ComponentLink3URL: https://datasheet.ciiva.com:443/pdfs/VipMasterIC/IC/WATC/WATC-S-A0009550342/WATC-S-A0009550342-1.pdf?src-supplier=IHS+Markit; ComponentLink3Description: https://datasheet.ciiva.com:443/pdfs/VipMasterIC/IC/WATC/WATC-S-A0009550342/WATC-S-A0009550342-1.pdf?src-supplier=IHS+Markit; ComponentLink4URL: http://www.farnell.com/datasheets/2340522.pdf?src-supplier=Farnell; ComponentLink4Description: http://www.farnell.com/datasheets/2340522.pdf?src-supplier=Farnell; ComponentLink5URL: http://components.arrow.com/part/dataview/0323_00654690?src-supplier=Arrow+Europe; ComponentLink5Description: http://components.arrow.com/part/dataview/0323_00654690?src-supplier=Arrow+Europe; ComponentLink6URL: https://www.verical.com/server-webapp/html/getDatasheet?partID=415228&src-supplier=Verical; ComponentLink6Description: https://www.verical.com/server-webapp/html/getDatasheet?partID=415228&src-supplier=Verical; ComponentLink7URL: http://www.passivecomponent.com/indexsea/0402B104K160CT-IN.pdf?src-supplier=Digi-Key; ComponentLink7Description: http://www.passivecomponent.com/indexsea/0402B104K160CT-IN.pdf?src-supplier=Digi-Key; ComponentLink8URL: http://www.passivecomponent.com/wp-content/uploads/2018/10/MLCC.pdf?src-supplier=Digi-Key; ComponentLink8Description: http://www.passivecomponent.com/wp-content/uploads/2018/10/MLCC.pdf?src-supplier=Digi-Key; ComponentLink9URL: http://www.farnell.com/datasheets/2340522.pdf?src-supplier=Element14; ComponentLink9Description: http://www.farnell.com/datasheets/2340522.pdf?src-supplier=Element14; ComponentLink10URL: http://www.farnell.com/datasheets/2340522.pdf?src-supplier=Newark; ComponentLink10Description: http://www.farnell.com/datasheets/2340522.pdf?src-supplier=Newark; Size Code: 0402; Supplier 3: Digi-Key; Supplier Part Number 3: 445-173645-1-ND; Stock 3: 3627; Pricing 3: 1=0.20000, 10=0.14200, 50=0.08080, 100=0.06700, 500=0.04696, 1000=0.03888, 2500=0.03619, 5000=0.03311 (USD); ComponentLink11URL: https://datasheet.ciiva.com:443/pdfs/VipMasterIC/IC/TDKC/TDKC-S-A0007785269/TDKC-S-A0007785269-1.pdf?src-supplier=IHS+Markit; ComponentLink11Description: https://datasheet.ciiva.com:443/pdfs/VipMasterIC/IC/TDKC/TDKC-S-A0007785269/TDKC-S-A0007785269-1.pdf?src-supplier=IHS+Markit; ComponentLink12URL: https://product.tdk.com/info/en/catalog/spec/mlccspec_commercial_soft_en.pdf?src-supplier=Digi-Key; ComponentLink12Description: https://product.tdk.com/info/en/catalog/spec/mlccspec_commercial_soft_en.pdf?src-supplier=Digi-Key
C133 = CAP_10uF_10V_0603: as C215 on sheet RGMII ETHERNET; Supplier Part Number 1: 311-1817-1-ND; Supplier 1: Digi-Key; Dielectric: X5R
C134 = CAP_10pF_50V_0402: Ceramic Capacitor, Multilayer, Ceramic, 50V, 1% +Tol, 1% -Tol, C0G, 30ppm/Cel TC, 0.00001uF, Surface Mount, 0402; Package: 0402
C135 = CAP_10nF_16V_0805: CAP CER 10000PF 16V X7R 0805; Manufacturer 1: Yageo; Manufacturer Part Number 1: AC0805KRX7R7BB103; Supplier 1: Digi-Key; Supplier Part Number 1: 311-3161-1-ND
D8 D10 D11 = TVS_DIODE_UNIDIR_5V: TVS DIODE 5VWM 12.3VC SOD923; Manufacturer 1: ON Semiconductor; Min Breakdown Voltage: 6.2V; Clamping Voltage-Max: 12.3V; Supplier 1: Digi-Key; Supplier Part Number 1: ESD9X5.0ST5GOSCT-ND
D9 = DIODE_30V_SOT323: Diode Array 1 Pair Common Cathode Schottky 30 V 200mA (DC) Surface Mount SC-70, SOT-323; Vendor: Diodes Inc; Built_By: EMA_Anthony; SourceLibrary: Diodes_Inc_2018-12-15; Type: DEV; Copyright: Copyright (C) 2016 Accelerated Designs. All rights reserved; RefDes: RefDes; Manufacturer_Part_Number: BAT54CW-7-F
J2 = CON_4POS: CONN HEADER VERT 4POS 2.54MM; Manufacturer: Molex; Supplier 1: Digi-Key; Supplier Part Number 1: 0022045048-ND; RoHS: Yes; Category: Headers and Wire Housings; Pricing 1: 16000=0.12858 (USD); ComponentLink1URL: https://datasheet.ciiva.com/6839/022045032-sd-6839882.pdf?src-supplier=Digi-Key; ComponentLink1Description: https://datasheet.ciiva.com/6839/022045032-sd-6839882.pdf?src-supplier=Digi-Key
Q8 Q9 = NMOS_30V_0.25A: MOSFET 2N-CH 30V 0.25A SOT-363; Manufacturer 1: ON Semiconductor; Supplier 1: Digi-Key; Supplier Part Number 1: NTJD4001NT1GOSCT-ND
R40 R44 = RES_4.7kΩ_0603_5%: RES 4.7K OHM 5% 1/10W 0603; Manufacturer 1: Yageo; Manufacturer Part Number 1: RC0603JR-074K7L; Supplier Part Number 1: 311-4.7KGRCT-ND; Supplier 1: Digi-Key
R41 R46 = RES_100kΩ_0402_5%: RES SMD 100K OHM 5% 1/10W 0402; Manufacturer Part Number 1: ERJ-2GEJ104X; Manufacturer 1: Panasonic Electronic Components; Power: 0.1W, 1/10W; Package/Footprint: 0402; Supplier 1: Digi-Key; Supplier Part Number 1: P100KJCT-ND; Mounting Type: SMD; Tolerance: 5%
R42 = RES_10kΩ_0603_5%: RES 10K OHM 5% 1/10W 0603; Manufacturer 1: Yageo; Manufacturer Part Number 1: RC0603JR-0710KL; Package/Footprint: 0603; Supplier Part Number 1: 311-10KGRCT-ND; Supplier 1: Digi-Key; Mounting Type: SMD
R43 = RES_100Ω_0603_1%: RES 100 OHM 1% 1/10W 0603; Manufacturer 1: Yageo; Manufacturer Part Number 1: RC0603FR-07100RL; Supplier Part Number 1: 311-100HRCT-ND; Supplier 1: Digi-Key
R45 = RES_0Ω_0603: as R95-R109 on sheet RGMII ETHERNET; Supplier Part Number 1: 311-0.0GRCT-ND; Supplier 1: Digi-Key; Mounting Type: SMD
S1-S3 = SW_TL3305A: TL3305A Series SPST 12 V 4.5 x 4.5 mm 260 gf Top Actuated SMT Tactile Switch; Manufacturer Part Number: TL3305AF260QG

## Sheet Debug UART.SchDoc: Debug UART
size 431 x 279 mm; CheckedBy: Lance Bantoto; Engineer: Chealsie Bains; DocumentNumber: 22; Revision: 1; SheetNumber: 22; SheetTotal: 23
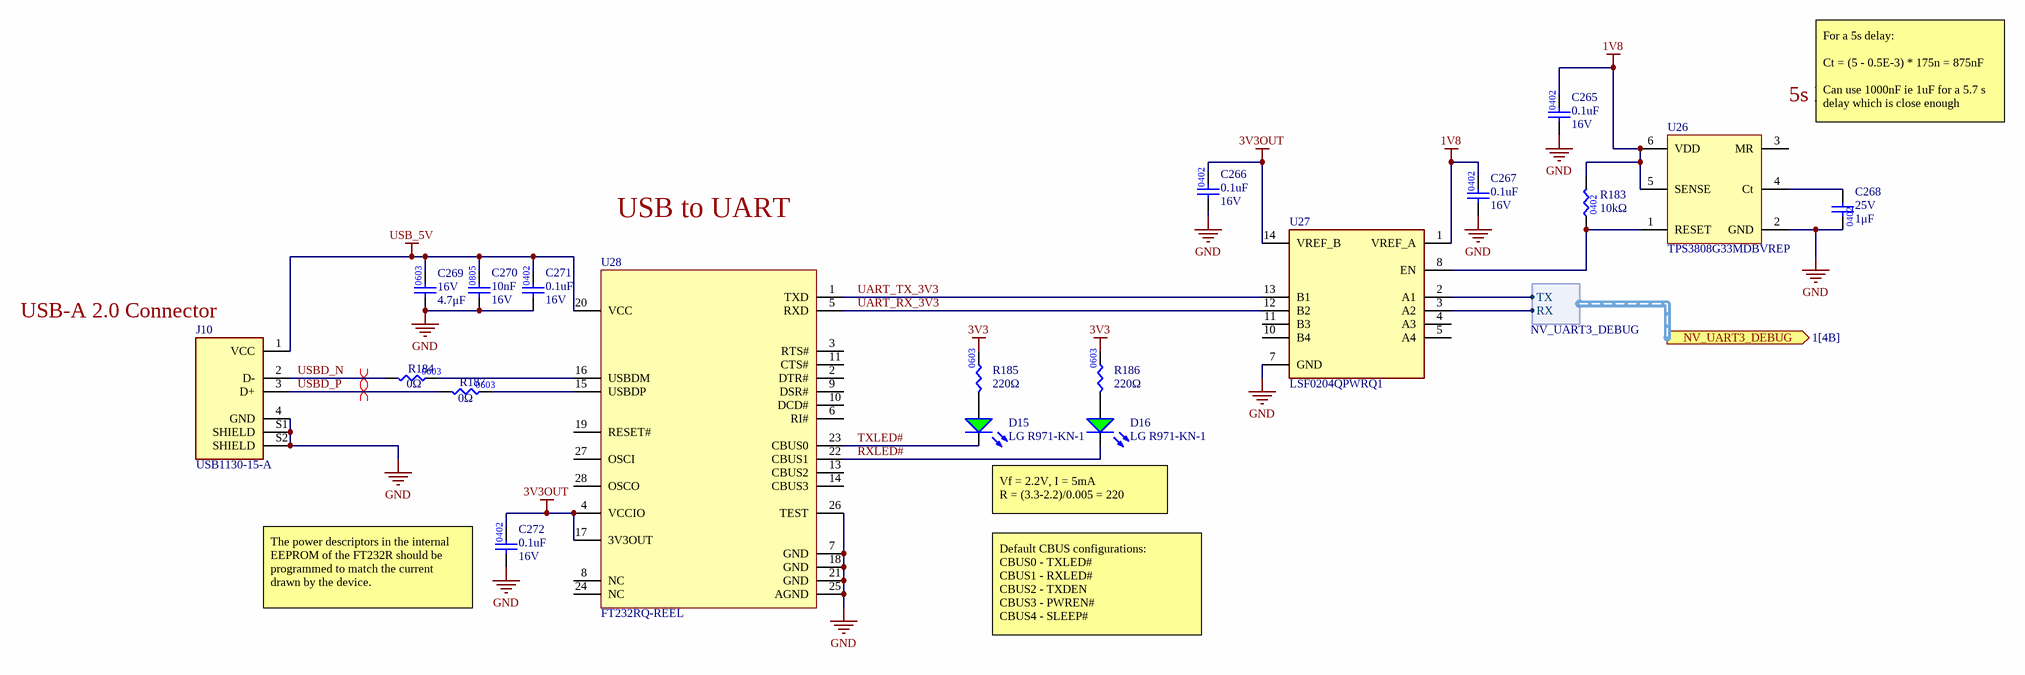
[diagram p21: Debug UART.SchDoc]

### Parts
C265  Capacitance: 0.1uF  Voltage Rating: 16V  [CAP0402]  (hidden comment: CAP_0.1uF_16V_X7R_0402)
C266  Capacitance: 0.1uF  Voltage Rating: 16V  [CAP0402]  (hidden comment: CAP_0.1uF_16V_X7R_0402)
C267  Capacitance: 0.1uF  Voltage Rating: 16V  [CAP0402]  (hidden comment: CAP_0.1uF_16V_X7R_0402)
C268  value 1μF  Voltage: 25V  [CAP0402]  (hidden comment: CAP_1uF_25V_0402)
C269  value 4.7μF  Voltage Rating: 16V  [CAP0603]  (hidden comment: CAP_4.7uF_16V_0603)
C270  value 10nF  Voltage Rating: 16V  [CAP2012]  (hidden comment: CAP_10nF_16V_0805)
C271  Capacitance: 0.1uF  Voltage Rating: 16V  [CAP0402]  (hidden comment: CAP_0.1uF_16V_X7R_0402)
C272  Capacitance: 0.1uF  Voltage Rating: 16V  [CAP0402]  (hidden comment: CAP_0.1uF_16V_X7R_0402)
D15  Manufacturer Part Number 1: LG R971-KN-1  [LED_0805_GREEN]  (hidden comment: LED_GREEN)
D16  Manufacturer Part Number 1: LG R971-KN-1  [LED_0805_GREEN]  (hidden comment: LED_GREEN)
J10  Manufacturer Part Number 1: USB1130-15-A  [USB-A 2.0 Connector]  (hidden comment: USB-A 2.0 Connector)
R183  Resistance: 10kΩ  [RES0402]  (hidden comment: RES_10kΩ_0402_1%)
R184  value 0Ω  [RES0603]  (hidden comment: RES_0Ω_0603)
R185  value 220Ω  [RES0603]  (hidden comment: RES_220Ω_0603)
R186  value 220Ω  [RES0603]  (hidden comment: RES_220Ω_0603)
R187  value 0Ω  [RES0603]  (hidden comment: RES_0Ω_0603)
U26  TPS3808G33MDBVREP  [TPS3808G33MDBVREP]
U27  LSF0204QPWRQ1  [SOP65P640X120-14N]
U28  FT232RQ-REEL  [FT232RQ-REEL_FTD]

### Ports
NV_UART3_DEBUG (out, harness NV_UART3_DEBUG, see 1[4B])

### Harnesses
NV_UART3_DEBUG: RX, TX

### Nets
1V8: C265.2 C267.2 R183.2 U26.5(SENSE) U26.6(VDD) U27.1(VREF_A)
3V3: R185.2 R186.2
3V3OUT: C266.2 C272.2 U27.14(VREF_B) U28.4(VCCIO) U28.17(3V3OUT)
GND: C265.1 C266.1 C267.1 C268.1 C269.1 C270.1 C271.1 C272.1 J10.4(GND) J10.S1(SHIELD) J10.S2(SHIELD) U26.2(GND) U27.7(GND) U28.7(GND) U28.18(GND) U28.21(GND) U28.25(AGND) U28.26(TEST)
USB_5V: C269.2 C270.2 C271.2 J10.1(VCC) U28.20(VCC)
NV_UART3_DEBUG.RX: U27.3(A2) ; port NV_UART3_DEBUG.RX
NV_UART3_DEBUG.TX: U27.2(A1) ; port NV_UART3_DEBUG.TX
RXLED#: D16.2(K) U28.22(CBUS1)
TXLED#: D15.2(K) U28.23(CBUS0)
UART_RX_3V3: U27.12(B2) U28.5(RXD)
UART_TX_3V3: U27.13(B1) U28.1(TXD)
USBD_N: J10.2(D-) R184.1
USBD_P: J10.3(D+) R187.1
NetC268_2: C268.2 U26.4(Ct)
NetD15_1: D15.1(A) R185.1
NetD16_1: D16.1(A) R186.1
NetR183_1: R183.1 U26.1(RESET) U27.8(EN)
NetR184_2: R184.2 U28.16(USBDM)
NetR187_2: R187.2 U28.15(USBDP)

Not connected (* = marked no-connect by the designer): U26 3(MR); U27 4(A3) 5(A4) 10(B4) 11(B3); U28 2(DTR#) 3(RTS#) 6(RI#) 8(NC) 9(DSR#) 10(DCD#) 11(CTS#) 13(CBUS2) 14(CBUS3) 19(RESET#) 24(NC) 27(OSCI) 28(OSCO)

### Layout directives
differential pair: USBD_N, USBD_P

### Notes on the sheet
- (near U26) 5s Delay Buffer
- For a 5s delay:
  Ct = (5 - 0.5E-3) * 175n = 875nF
  Can use 1000nF ie 1uF for a 5.7 s delay which is close enough
- USB to UART
- (near J10) USB-A 2.0 Connector
- Vf = 2.2V, I = 5mA
  R = (3.3-2.2)/0.005 = 220
- (near C272) The power descriptors in the internal EEPROM of the FT232R should be programmed to match the current
  drawn by the device.
- Default CBUS configurations:
  CBUS0 - TXLED#
  CBUS1 - RXLED#
  CBUS2 - TXDEN
  CBUS3 - PWREN#
  CBUS4 - SLEEP#
- University of Waterloo Robotics Team
- 200 University Ave W
- REV
- PROJECT
- Waterloo, Ontario, Canada
- N2L 3G1
- DOCUMENT
- ENGINEER
- REVIEWER
- MODIFIED
- SHEET
- OF
- (in symbol CAP_10nF_16V_0805) 0805

### Library data of the parts
C265-C267 C271 C272 = CAP_0.1uF_16V_X7R_0402: CAP CER 0.1UF 16V X7R 0402; Supplier 1: Digi-Key; Mounting Type: Surface Mount; Package: 0402
C268 = CAP_1uF_25V_0402: CAP CER 1UF 25V X5R 0402; Manufacturer 1: TDK Corporation; Manufacturer Part Number 1: C1005X5R1E105K050BE; Supplier 1: Digi-Key; Supplier Part Number 1: 445-175215-1-ND; Package: 0402
C269 = CAP_4.7uF_16V_0603: CAP CER 4.7UF 16V X6S 0603; Manufacturer Part Number 1: GRM188C81C475KE11D; Manufacturer 1: Murata Electronics; Supplier Part Number 1: 490-13362-1-ND; Supplier 1: Digi-Key; Mounting Type: SMD; Dielectric: X6S; Package: 0603
C270 = CAP_10nF_16V_0805: as C135 on sheet System; Supplier 1: Digi-Key; Supplier Part Number 1: 311-3161-1-ND
D15 D16 = LED_GREEN: LED GREEN DIFFUSED 0805 SMD; Manufacturer 1: OSRAM; Forward Voltage Drop: 2.2V; Package/Footprint: 0805; Supplier Part Number 1: 475-1410-1-ND; Supplier 1: Digi-Key; Mounting Type: SMD
J10 = USB-A 2.0 Connector: USB-A (USB TYPE-A) USB 2.0 Receptacle Connector 4 Position Through Hole, Right Angle; Manufacturer 1: GCT; Supplier 1: Digi-Key; Supplier Part Number 1: 2073-USB1130-15-ACT-ND
R183 = RES_10kΩ_0402_1%: RES 10K OHM 1% 1/16W 0402; Manufacturer Part Number 1: RC1005F103CS; Manufacturer 1: Samsung Electro-Mechanics; Supplier 1: Digi-Key; Supplier Part Number 1: 1276-3431-1-ND; Tolerance: 1%; Package: 0402
R184 R187 = RES_0Ω_0603: RES 0 OHM JUMPER 1/10W 0603; Manufacturer 1: Yageo; Manufacturer Part Number 1: RC0603JR-070RL; Supplier Part Number 1: 311-0.0GRCT-ND; Supplier 1: Digi-Key; Mounting Type: SMD; Package: 0603
R185 R186 = RES_220Ω_0603_5%: as R110 on sheet RGMII ETHERNET; Supplier Part Number 1: YAG3652CT-ND; Supplier 1: Digi-Key
U26 = TPS3808G33MDBVREP: IC SUPERVISOR 1 CHANNEL SOT23-6; Manufacturer 1: Texas Instruments; Supplier 1: Digi-Key; Supplier Part Number 1: 296-23569-1-ND; Manufacturer Part Number 1: TPS3808G33MDBVREP
U27 = LSF0204QPWRQ1: 4-BITS MULTI-VOLTAGE LEVEL TRANS; Manufacturer 1: Texas Instruments; Channel Type: Bidirectional; Channels per Circuit: 4; Output Type: Open Drain, Push Pull; Data Rate: 100MBd; Voltage - VCCA: 0.8V - 4.5V; Voltage - VCCB: 1.8V - 5.5V; Manufacturer Part Number 1: LSF0204QPWRQ1; Supplier 1: Digi-Key; Supplier Part Number 1: 296-51425-1-ND; Package: 14-TSSOP
U28 = FT232RQ-REEL: USB Bridge, USB to UART USB 2.0 UART Interface 32-QFN (5x5); Manufacturer: FTDI; Max Frequency: 48MHz; Package Equivalence Code: LCC32,.2SQ,20; Max Supply Voltage: 5.25V; Min Supply Voltage: 3.3V; Max Supply Current: 100uA; Qualification Status: Not Qualified; Supplier 1: Digi-Key; Supplier Part Number 1: 768-1008-1-ND; RoHS: Yes; Category: Interface ICs; Pricing 1: 1=4.70000, 10=4.25000, 50=4.05000, 100=3.85000, 250=3.45000, 500=3.05000, 1000=2.85002, 2500=2.55001 (USD); Package Code: HVQCCN; Number of Pins: 32; Package Shape: Square; Min Operating Temperature: -40°C; Max Operating Temperature: 85°C; JESD-30 Code: S-XQCC-N32; Moisture Sensitivity Level: 3; Package Style: CHIP CARRIER, HEAT SINK/SLUG, VERY THIN PROFILEMeter; Surface Mount: Yes; Technology: CMOS; Terminal Form: No Lead; Terminal Position: QUAD; Length: 5mm; Width: 5mm; Height - Seated (Max): 1mm; Terminal Pitch: 0.5mm; Temperature Grade: INDUSTRIAL; REACH SVHC: Yes; RoHS Compliant: Yes; ComponentLink1URL: https://datasheet.ciiva.com:443/pdfs/VipMasterIC/IC/FTDI/FTDI-S-A0007980421/FTDI-S-A0007980421-1.pdf?src-supplier=IHS+Markit; ComponentLink1Description: https://datasheet.ciiva.com:443/pdfs/VipMasterIC/IC/FTDI/FTDI-S-A0007980421/FTDI-S-A0007980421-1.pdf?src-supplier=IHS+Markit; ComponentLink2URL: https://datasheet.ciiva.com/1505/1647396-1505445.pdf?src-supplier=Digi-Key; ComponentLink2Description: https://datasheet.ciiva.com/1505/1647396-1505445.pdf?src-supplier=Digi-Key; ComponentLink3URL: https://datasheet.ciiva.com/26841/ft232rq-reel-26841082.pdf?src-supplier=IIIC; ComponentLink3Description: https://datasheet.ciiva.com/26841/ft232rq-reel-26841082.pdf?src-supplier=IIIC; ComponentLink4URL: https://datasheet.ciiva.com/16438/ds-ft232r-16438555.pdf?src-supplier=Future+Electronics; ComponentLink4Description: https://datasheet.ciiva.com/16438/ds-ft232r-16438555.pdf?src-supplier=Future+Electronics; ComponentLink5URL: https://datasheet.ciiva.com/15150/getdatasheetpartid-644721-15150509.pdf?src-supplier=Verical; ComponentLink5Description: https://datasheet.ciiva.com/15150/getdatasheetpartid-644721-15150509.pdf?src-supplier=Verical; ComponentLink6URL: https://datasheet.ciiva.com/4787/ds-ft232r-4787663.pdf?src-supplier=Mouser; ComponentLink6Description: https://datasheet.ciiva.com/4787/ds-ft232r-4787663.pdf?src-supplier=Mouser; ComponentLink7URL: https://datasheet.ciiva.com/1787/ds-ft232r-1787041.pdf?src-supplier=Digi-Key; ComponentLink7Description: https://datasheet.ciiva.com/1787/ds-ft232r-1787041.pdf?src-supplier=Digi-Key; ComponentLink8URL: https://datasheet.ciiva.com/1787/ds-ft232r-1787042.pdf?src-supplier=Digi-Key; ComponentLink8Description: https://datasheet.ciiva.com/1787/ds-ft232r-1787042.pdf?src-supplier=Digi-Key; Manufacturer Part Number: FT232RQ-REEL

## Sheet POWER CONNECTOR.SchDoc: Power Connector
size 279 x 215 mm; CheckedBy: Lance Bantoto; Engineer: Cindy Li; DocumentNumber: 2; Revision: 1; SheetNumber: 2; SheetTotal: 23
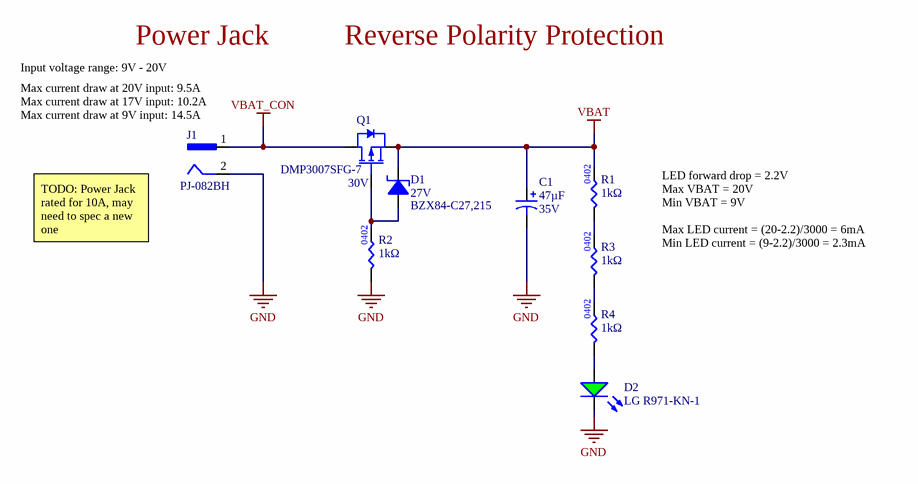
[diagram p22: POWER CONNECTOR.SchDoc]

### Parts
C1  value 47µF  Voltage Rating: 35V  [RADIAL_CORNELL_D]  (hidden comment: CAP_47uF_35V_ALUM)
D1  Working Voltage: 27V  [BZX84-C27,215]  (hidden comment: DIO_ZENER_27V)
D2  Manufacturer Part Number 1: LG R971-KN-1  [LED_0805_GREEN]  (hidden comment: DIO_LED_G)
J1  Manufacturer Part Number 1: PJ-082BH  [CUI_PJ-082BH]  (hidden comment: CON_POWER_JACK)
Q1  Vdss: 30V  [DMP3007SFG-7]  (hidden comment: PMOS_30V_70A)
R1  Resistance: 1kΩ  [RES0402]  (hidden comment: RES_1kΩ_0402)
R2  Resistance: 1kΩ  [RES0402]  (hidden comment: RES_1kΩ_0402)
R3  Resistance: 1kΩ  [RES0402]  (hidden comment: RES_1kΩ_0402)
R4  Resistance: 1kΩ  [RES0402]  (hidden comment: RES_1kΩ_0402)

### Nets
GND: C1.2 D2.2(K) J1.2 R2.1
VBAT: C1.1 D1.3(Cathode) Q1.3(Source) R1.2
VBAT_CON: J1.1 Q1.1(Drain)
NetD1_1: D1.1(Anode) Q1.2(Gate) R2.2
NetD2_1: D2.1(A) R4.1
NetR1_1: R1.1 R3.2
NetR3_1: R3.1 R4.2

### Notes on the sheet
- Input voltage range: 9V - 20V
- Power Jack
- Reverse Polarity Protection
- (near J1) Max current draw at 20V input: 9.5A
  Max current draw at 17V input: 10.2A
  Max current draw at 9V input: 14.5A
- TODO: Power Jack rated for 10A, may need to spec a new one
- LED forward drop = 2.2V
  Max VBAT = 20V
  Min VBAT = 9V
  Max LED current = (20-2.2)/3000 = 6mA
  Min LED current = (9-2.2)/3000 = 2.3mA
- University of Waterloo Robotics Team
- 200 University Ave W
- REV
- PROJECT
- Waterloo, Ontario, Canada
- N2L 3G1
- DOCUMENT
- ENGINEER
- REVIEWER
- MODIFIED
- SHEET
- OF

### Library data of the parts
C1 = CAP_47uF_35V_ALUM: CAP ALUM POLY HYB 47UF 35V SMD; Manufacturer 1: Cornell Dubilier Electronics (CDE); Manufacturer Part Number 1: HZA476M035D16T-F; Supplier 1: Digi-Key; Supplier Part Number 1: HZA476M035D16T-FCT-ND; Mounting Type: SMD; Package/Footprint: SMD
D1 = DIO_ZENER_27V: DIODE ZENER 27V 250MW SOT23; Manufacturer 1: Nexperia USA Inc.; Forward Voltage: 0.9V; Manufacturer Part Number 1: BZX84-C27,215; Supplier Part Number 1: 1727-5026-2-ND; Supplier 1: Digi-Key
D2 = DIO_LED_G: LED GREEN DIFFUSED 0805 SMD; Manufacturer 1: OSRAM; Forward Voltage Drop: 2.2V; Package/Footprint: 0805; Supplier Part Number 1: 475-1410-1-ND; Supplier 1: Digi-Key; Mounting Type: SMD
J1 = CON_POWER_JACK: CONN PWR JACK 2.5X5.5MM SOLDER; Manufacturer 1: CUI Devices; Voltage Rating: 24VDC; Current Rating: 10A; Supplier 1: Digi-Key; Supplier Part Number 1: CP-082BHCT-ND
Q1 = PMOS_30V_70A: MOSFET P-CH 30V 70A POWERDI3333; Manufacturer 1: Diodes Incorporated; Vgs (Max): 25V; Power Dissipation (Max): 2.8W (Ta); Package/Footprint: PowerDI3333-8; Supplier 1: Digi-Key; Supplier Part Number 1: DMP3007SFG-7DICT-ND; Manufacturer Part Number 1: DMP3007SFG-7; Mounting Type: SMD; Verified: No; Id: 70A
R1-R4 = RES_1kΩ_0402: Fixed Resistor, Metal Glaze/thick Film, 0.063W, 1000ohm, 50V, 1% +/-Tol, 100ppm/Cel, Surface Mount, 0402; Manufacturer: Stackpole Electronics; Manufacturer Part Number: RMCF0402FT1K00; Rated Power Dissipation (P): 63mW; Rated Temperature: 70°C; Temperature Coefficient: 100ppm/°C; Package Height: 0.3mm; Package Length: 1mm; Package Width: 0.5mm; Reference Standard: AEC-Q200; Supplier 1: Digi-Key; Supplier Part Number 1: RMCF0402FT1K00CT-ND; RoHS: Yes; Category: Chip SMD Resistors; Stock 1: 277; Pricing 1: 1=0.10000, 10=0.01500, 100=0.00610, 1000=0.00274, 2500=0.00238, 5000=0.00197 (USD); Mount: Surface Mount; Number of Pins: 2; Package Shape: Rectangular; Terminal Finish: Nickel; Min Operating Temperature: -55°C; Max Operating Temperature: 155°C; Tolerance: 1%; JESD-609 Code: e3; Resistor Type: FIXED RESISTOR; Construction: Rectangular; Package Style: SMTMeter; Packaging: Tape and Reel; Technology: METAL GLAZE/THICK FILM; Termination: Wraparound; Working Voltage: 50V; REACH SVHC: Yes; RoHS Compliant: Yes; ComponentLink1URL: https://datasheet.ciiva.com:443/pdfs/VipMasterIC/IC/SEIE/SEIE-S-A0009541969/SEIE-S-A0009541969-1.pdf?src-supplier=IHS+Markit; ComponentLink1Description: https://datasheet.ciiva.com:443/pdfs/VipMasterIC/IC/SEIE/SEIE-S-A0009541969/SEIE-S-A0009541969-1.pdf?src-supplier=IHS+Markit; ComponentLink2URL: https://datasheet.ciiva.com/15193/getdatasheetpartid-365385-15193418.pdf?src-supplier=Verical; ComponentLink2Description: https://datasheet.ciiva.com/15193/getdatasheetpartid-365385-15193418.pdf?src-supplier=Verical; ComponentLink3URL: https://datasheet.ciiva.com/24336/sei-rmcp-24336266.pdf?src-supplier=Onlinecomponents.com; ComponentLink3Description: https://datasheet.ciiva.com/24336/sei-rmcp-24336266.pdf?src-supplier=Onlinecomponents.com; Size Code: 0402